# EAGLE design old_main_board (EAGLE 7.7.0)
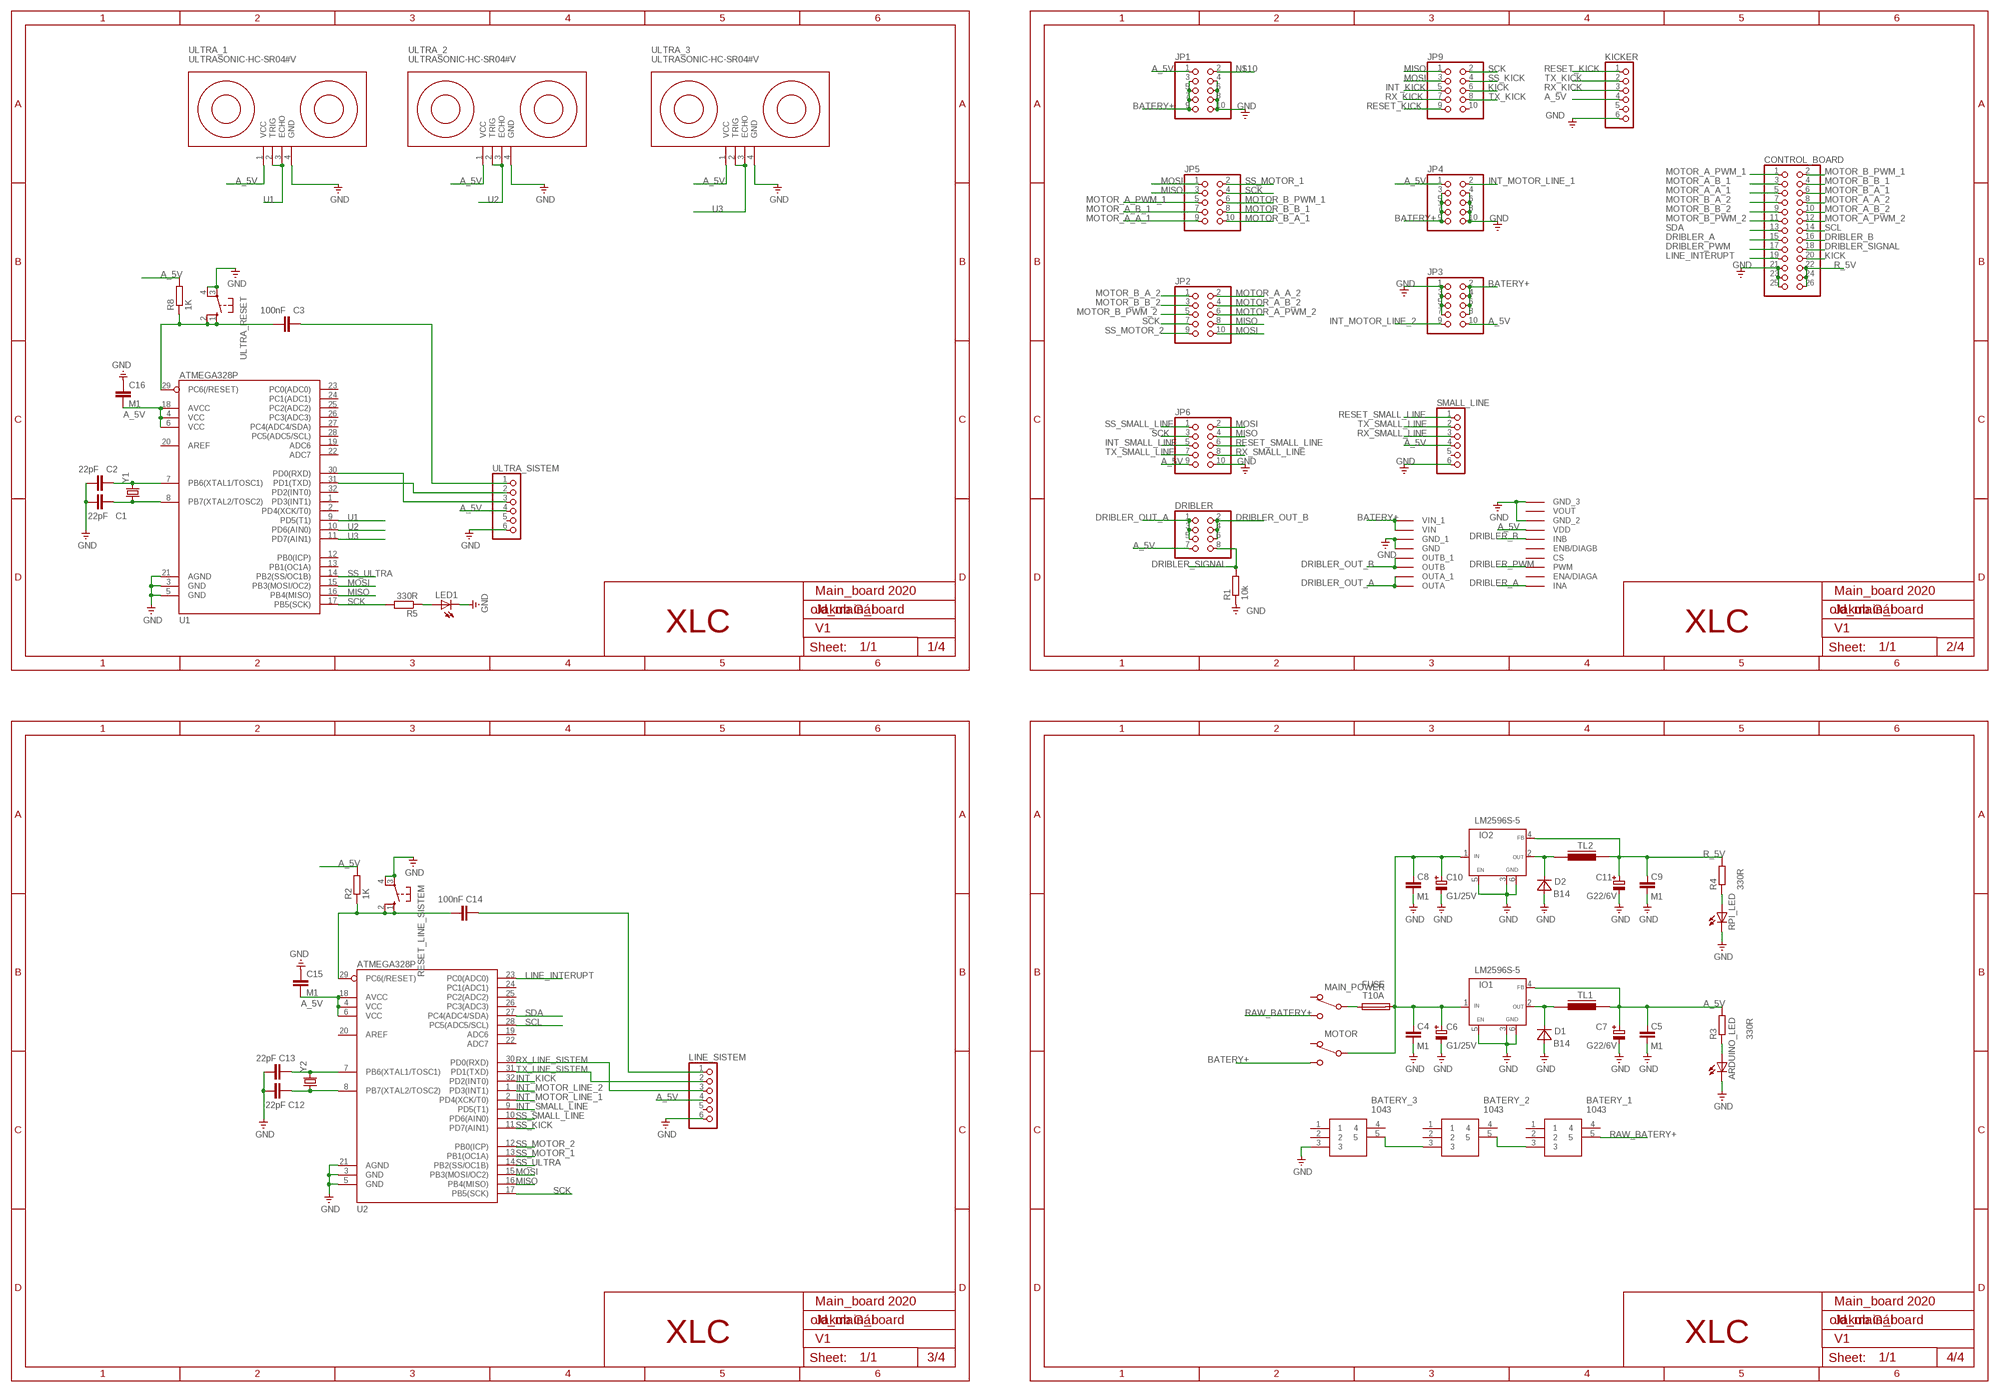
[diagram p0: schematic, sheet 1]

## Parts
ARDUINO_LED  LEDCHIPLED_0603  [CHIPLED_0603]
BATERY_1  1043  [1043]
BATERY_2  1043  [1043]
BATERY_3  1043  [1043]
C1  22pF  C-EUC0603  [C0603]
C2  22pF  C-EUC0603  [C0603]
C3  100nF  C-EUC0603  [C0603]
C4  M1  KOND-KERAM1206-SMD  [SMD-1206]
C5  M1  KOND-KERAM1206-SMD  [SMD-1206]
C6  G1/25V  KOND-ELEKTD-SMD  [SMD-ELE-D]
C7  G22/6V  KOND-ELEKTD-SMD  [SMD-ELE-D]
C8  M1  KOND-KERAM1206-SMD  [SMD-1206]
C9  M1  KOND-KERAM1206-SMD  [SMD-1206]
C10  G1/25V  KOND-ELEKTD-SMD  [SMD-ELE-D]
C11  G22/6V  KOND-ELEKTD-SMD  [SMD-ELE-D]
C12  22pF  C-EUC0603  [C0603]
C13  22pF  C-EUC0603  [C0603]
C14  100nF  C-EUC0603  [C0603]
C15  M1  C-EUC0603  [C0603]
C16  M1  C-EUC0603  [C0603]
CONTROL_BOARD  PINHD-2X13_2.54  [2X13]
D1  B14  DIODASMD-3,6X5,5  [D-3,6X5,5]
D2  B14  DIODASMD-3,6X5,5  [D-3,6X5,5]
DRIBLER  PINHD-2X4_2.54-SMD  [2X04SMD]
FUSE  T10A  POISTKA2A  [SH22,5A]
IO1  LM2596S-5  LM2596S  [TO263-5]
IO2  LM2596S-5  LM2596S  [TO263-5]
JP1  PINHD-2X5IDC  [2X05_IDC]
JP2  PINHD-2X5IDC  [2X05_IDC]
JP3  PINHD-2X5IDC  [2X05_IDC]
JP4  PINHD-2X5IDC  [2X05_IDC]
JP5  PINHD-2X5IDC  [2X05_IDC]
JP6  PINHD-2X5IDC  [2X05_IDC]
JP9  PINHD-2X5IDC  [2X05_IDC]
KICKER  PINHD-1X6  [1X06]
LED1  LEDCHIPLED_0603  [CHIPLED_0603]
LINE_SISTEM  PINHD-1X6  [1X06]
MAIN_POWER  PREP-1PB  [P-B069B]
MOTOR  PREP-1PB  [P-B069B]
R1  10k  R-EU_R0603  [R0603]
R2  1K  R-EU_R0603  [R0603]
R3  330R  R-EU_R0603  [R0603]
R4  330R  R-EU_R0603  [R0603]
R5  330R  R-EU_R0603  [R0603]
R8  1K  R-EU_R0603  [R0603]
RESET_LINE_SISTEM  10-XX  [B3F-10XX]
RPI_LED  LEDCHIPLED_0603  [CHIPLED_0603]
SMALL_LINE  PINHD-1X6  [1X06]
TL1  INDUK-TLSMD1  [INDUK-TL]
TL2  INDUK-TLSMD1  [INDUK-TL]
U1  ATMEGA328P  ATMEGA328_SMT  [TQFP32-08]
U2  ATMEGA328P  ATMEGA328_SMT  [TQFP32-08]
U$4  MOTOR_DRIVER  [MOTOR_DRIVER]
ULTRA_1  ULTRASONIC-HC-SR04#V  [ULTRASONIC-HC-SR04#V]
ULTRA_2  ULTRASONIC-HC-SR04#V  [ULTRASONIC-HC-SR04#V]
ULTRA_3  ULTRASONIC-HC-SR04#V  [ULTRASONIC-HC-SR04#V]
ULTRA_RESET  10-XX  [B3F-10XX]
ULTRA_SISTEM  PINHD-1X6  [1X06]
Y1  CRYSTALHC49US  [HC49US]
Y2  CRYSTALHC49US  [HC49US]

## Nets
A_5V: C5.2 C7.PLUS C15.2 C16.2 DRIBLER.7 IO1.4(FB) JP1.1 JP3.10 JP4.1 JP6.9 KICKER.4 LINE_SISTEM.4 R2.2 R3.2 R8.2 SMALL_LINE.4 TL1.2 U1.4(VCC) U1.6(VCC) U1.18(AVCC) U2.4(VCC) U2.6(VCC) U2.18(AVCC) U$4.VDD ULTRA_1.1(VCC) ULTRA_2.1(VCC) ULTRA_3.1(VCC) ULTRA_SISTEM.4
BATERY+: JP1.3 JP1.5 JP1.7 JP1.9 JP3.2 JP3.4 JP3.6 JP3.8 JP4.3 JP4.5 JP4.7 JP4.9 MOTOR.1(1-OFF) U$4.VIN U$4.VIN_1
DRIBLER_A: CONTROL_BOARD.15 U$4.INA
DRIBLER_B: CONTROL_BOARD.16 U$4.INB
DRIBLER_OUT_A: DRIBLER.1 DRIBLER.3 DRIBLER.5 U$4.OUTA U$4.OUTA_1
DRIBLER_OUT_B: DRIBLER.2 DRIBLER.4 DRIBLER.6 U$4.OUTB U$4.OUTB_1
DRIBLER_PWM: CONTROL_BOARD.17 U$4.PWM
DRIBLER_SIGNAL: CONTROL_BOARD.18 DRIBLER.8 R1.2
GND: ARDUINO_LED.C BATERY_3.3 C1.1 C2.1 C4.1 C5.1 C6.MINUS C7.MINUS C8.1 C9.1 C10.MINUS C11.MINUS C12.1 C13.1 C15.1 C16.1 CONTROL_BOARD.21 CONTROL_BOARD.23 CONTROL_BOARD.25 D1.A D2.A IO1.3(GND) IO1.5(EN) IO1.6(GND) IO2.3(GND) IO2.5(EN) IO2.6(GND) JP1.4 JP1.6 JP1.8 JP1.10 JP3.1 JP3.3 JP3.5 JP3.7 JP4.4 JP4.6 JP4.8 JP4.10 JP6.10 KICKER.6 LED1.C LINE_SISTEM.6 R1.1 RESET_LINE_SISTEM.3(P) RESET_LINE_SISTEM.4(P1) RPI_LED.C SMALL_LINE.6 U1.3(GND) U1.5(GND) U1.21(AGND) U2.3(GND) U2.5(GND) U2.21(AGND) U$4.GND U$4.GND_1 U$4.GND_2 U$4.GND_3 ULTRA_1.4(GND) ULTRA_2.4(GND) ULTRA_3.4(GND) ULTRA_RESET.3(P) ULTRA_RESET.4(P1) ULTRA_SISTEM.6
INT_KICK: JP9.5 U2.32(PD2(INT0))
INT_MOTOR_LINE_1: JP4.2 U2.2(PD4(XCK/T0))
INT_MOTOR_LINE_2: JP3.9 U2.1(PD3(INT1))
INT_SMALL_LINE: JP6.5 U2.9(PD5(T1))
KICK: CONTROL_BOARD.20 JP9.6
LINE_INTERUPT: CONTROL_BOARD.19 U2.23(PC0(ADC0))
MISO: JP2.8 JP5.3 JP6.4 JP9.1 U1.16(PB4(MISO)) U2.16(PB4(MISO))
MOSI: JP2.10 JP5.1 JP6.2 JP9.3 U1.15(PB3(MOSI/OC2)) U2.15(PB3(MOSI/OC2))
MOTOR_A_A_1: CONTROL_BOARD.5 JP5.9
MOTOR_A_A_2: CONTROL_BOARD.8 JP2.2
MOTOR_A_B_1: CONTROL_BOARD.3 JP5.7
MOTOR_A_B_2: CONTROL_BOARD.10 JP2.4
MOTOR_A_PWM_1: CONTROL_BOARD.1 JP5.5
MOTOR_A_PWM_2: CONTROL_BOARD.12 JP2.6
MOTOR_B_A_1: CONTROL_BOARD.6 JP5.10
MOTOR_B_A_2: CONTROL_BOARD.7 JP2.1
MOTOR_B_B_1: CONTROL_BOARD.4 JP5.8
MOTOR_B_B_2: CONTROL_BOARD.9 JP2.3
MOTOR_B_PWM_1: CONTROL_BOARD.2 JP5.6
MOTOR_B_PWM_2: CONTROL_BOARD.11 JP2.5
N$1: BATERY_1.3 BATERY_2.5
N$2: BATERY_2.3 BATERY_3.5
N$3: D2.K IO2.2(OUT) TL2.1
N$4: FUSE.1 MAIN_POWER.2(2-COM)
N$5: C13.2 U2.7(PB6(XTAL1/TOSC1)) Y2.2
N$6: D1.K IO1.2(OUT) TL1.1
N$7: C2.2 U1.7(PB6(XTAL1/TOSC1)) Y1.2
N$8: C1.2 U1.8(PB7(XTAL2/TOSC2)) Y1.1
N$9: C12.2 U2.8(PB7(XTAL2/TOSC2)) Y2.1
N$10: JP1.2
N$12: C14.2 LINE_SISTEM.1
N$13: C14.1 R2.1 RESET_LINE_SISTEM.1(S) RESET_LINE_SISTEM.2(S1) U2.29(PC6(/RESET))
N$14: C4.2 C6.PLUS C8.2 C10.PLUS FUSE.2 IO1.1(IN) IO2.1(IN) MOTOR.2(2-COM)
N$16: U1.30(PD0(RXD)) ULTRA_SISTEM.3
N$17: U1.31(PD1(TXD)) ULTRA_SISTEM.2
N$18: C3.2 ULTRA_SISTEM.1
N$19: C3.1 R8.1 U1.29(PC6(/RESET)) ULTRA_RESET.1(S) ULTRA_RESET.2(S1)
N$20: LED1.A R5.1
N$22: ARDUINO_LED.A R3.1
N$23: R4.1 RPI_LED.A
R_5V: C9.2 C11.PLUS CONTROL_BOARD.22 CONTROL_BOARD.24 CONTROL_BOARD.26 IO2.4(FB) R4.2 TL2.2
RAW_BATERY+: BATERY_1.5 MAIN_POWER.1(1-OFF)
RESET_KICK: JP9.9 KICKER.1
RESET_SMALL_LINE: JP6.6 SMALL_LINE.1
RX_KICK: JP9.7 KICKER.3
RX_LINE_SISTEM: LINE_SISTEM.3 U2.30(PD0(RXD))
RX_SMALL_LINE: JP6.8 SMALL_LINE.3
SCK: JP2.7 JP5.4 JP6.3 JP9.2 R5.2 U1.17(PB5(SCK)) U2.17(PB5(SCK))
SCL: CONTROL_BOARD.14 U2.28(PC5(ADC5/SCL))
SDA: CONTROL_BOARD.13 U2.27(PC4(ADC4/SDA))
SS_KICK: JP9.4 U2.11(PD7(AIN1))
SS_MOTOR_1: JP5.2 U2.13(PB1(OC1A))
SS_MOTOR_2: JP2.9 U2.12(PB0(ICP))
SS_SMALL_LINE: JP6.1 U2.10(PD6(AIN0))
SS_ULTRA: U1.14(PB2(SS/OC1B)) U2.14(PB2(SS/OC1B))
TX_KICK: JP9.8 KICKER.2
TX_LINE_SISTEM: LINE_SISTEM.2 U2.31(PD1(TXD))
TX_SMALL_LINE: JP6.7 SMALL_LINE.2
U1: U1.9(PD5(T1)) ULTRA_1.2(TRIG) ULTRA_1.3(ECHO)
U2: U1.10(PD6(AIN0)) ULTRA_2.2(TRIG) ULTRA_2.3(ECHO)
U3: U1.11(PD7(AIN1)) ULTRA_3.2(TRIG) ULTRA_3.3(ECHO)
Unconnected: BATERY_1.1 BATERY_1.2 BATERY_1.4 BATERY_2.1 BATERY_2.2 BATERY_2.4 BATERY_3.1 BATERY_3.2 BATERY_3.4 JP9.10 KICKER.5 LINE_SISTEM.5 MAIN_POWER.3(3-ON) MOTOR.3(3-ON) SMALL_LINE.5 U1.1(PD3(INT1)) U1.2(PD4(XCK/T0)) U1.12(PB0(ICP)) U1.13(PB1(OC1A)) U1.19(ADC6) U1.20(AREF) U1.22(ADC7) U1.23(PC0(ADC0)) U1.24(PC1(ADC1)) U1.25(PC2(ADC2)) U1.26(PC3(ADC3)) U1.27(PC4(ADC4/SDA)) U1.28(PC5(ADC5/SCL)) U1.32(PD2(INT0)) U2.19(ADC6) U2.20(AREF) U2.22(ADC7) U2.24(PC1(ADC1)) U2.25(PC2(ADC2)) U2.26(PC3(ADC3)) U$4.CS U$4.ENA/DIAGA U$4.ENB/DIAGB U$4.VOUT ULTRA_SISTEM.5

## Notes on the sheet
- Main_board 2020 | Main_board 2020
- Jakub Gál | Jakub Gál
- XLC | V1 | XLC | V1
- 1/4 | 2/4
- Main_board 2020 | Main_board 2020
- Jakub Gál | Jakub Gál
- XLC | V1 | XLC | V1
- 3/4 | 4/4

## Library data of the parts
ARDUINO_LED LED1 RPI_LED = audio amplifier example:LED
BATERY_1-BATERY_3 = SamacSys_Parts:1043: KEYSTONE - 1043 - BATTERY HOLDER, 18650, TH Source: Datasheet <https://componentsearchengine.com/Datasheets/1/1043.pdf>; DESCRIPTION: KEYSTONE - 1043 - BATTERY HOLDER, 18650, TH; HEIGHT: mm; MANUFACTURER_NAME: Keystone Electronics; MANUFACTURER_PART_NUMBER: 1043; MOUSER_PART_NUMBER: 534-1043; MOUSER_PRICE-STOCK: https://www.mouser.com/Search/Refine.aspx?Keyword=534-1043
C1-C3 C12-C14 = rcl@1:C-EU: CAPACITOR, European symbol
C4 C5 C8 C9 = TABOR K1:KOND-KERAM: Kondenzátor keramicky
C6 C7 C10 C11 = TABOR K1:KOND-ELEKT: Kondenzátor elektrolyticky
C15 C16 = rcl:C-EU: CAPACITOR, European symbol; SPICEPREFIX: C
CONTROL_BOARD = pinhead-1:PINHD-2X13: PIN HEADER
D1 D2 = TABOR K1:DIODA: Dioda
DRIBLER = pinhead-1:PINHD-2X4: PIN HEADER
FUSE = TABOR K1:POISTKA2: Drziak sklopistky SH22,5A / vzdialenost vyvodov 22,5 mm /
IO1 IO2 = TABOR K1:LM2596: DC/DC pulzny regulator STEP-DOWN / 3A upraveny podla katalogu
JP1-JP6 JP9 = pinhead-1:PINHD-2X5: PIN HEADER
KICKER LINE_SISTEM SMALL_LINE ULTRA_SISTEM = pinhead:PINHD-1X6: PIN HEADER
MAIN_POWER MOTOR = TABOR K1:PREP-1P: 1-polovy prepinac
R1-R5 R8 = rcl:R-EU_: RESISTOR, European symbol; SPICEPREFIX: R
RESET_LINE_SISTEM ULTRA_RESET = switch-omron:10-XX: OMRON SWITCH; MPN: B3F-1000; OC_FARNELL: 176432; OC_NEWARK: 36M3542
TL1 TL2 = TABOR K1:INDUK-TL: Tlmivka
U1 U2 = SparkFun-DigitalIC:ATMEGA328_SMT: 32-Pin Atmega328 part Commonly used on Arduino compatible boards Available in QFP and QFN packages TQFP is IC-09069 QFN is non-stock; PROD_ID: IC-09069
U$4 = Moja:MOTOR_DRIVER
ULTRA_1-ULTRA_3 = diy-modules:ULTRASONIC-HC-SR04: Ultrasonic Ranging Module HC-SR04 More details available here: http://randomnerdtutorials.com/complete-guide-for-ultrasonic-sensor-hc-sr04/ Click here to find device on ebay.com <http://www.ebay.com/sch/hc+sr04+ultrasonic>
Y1 Y2 = SparkFun-FreqCtrl:CRYSTAL: Various standard crystals. Proven footprints. Spark Fun Electronics SKU : COM-00534

## Board
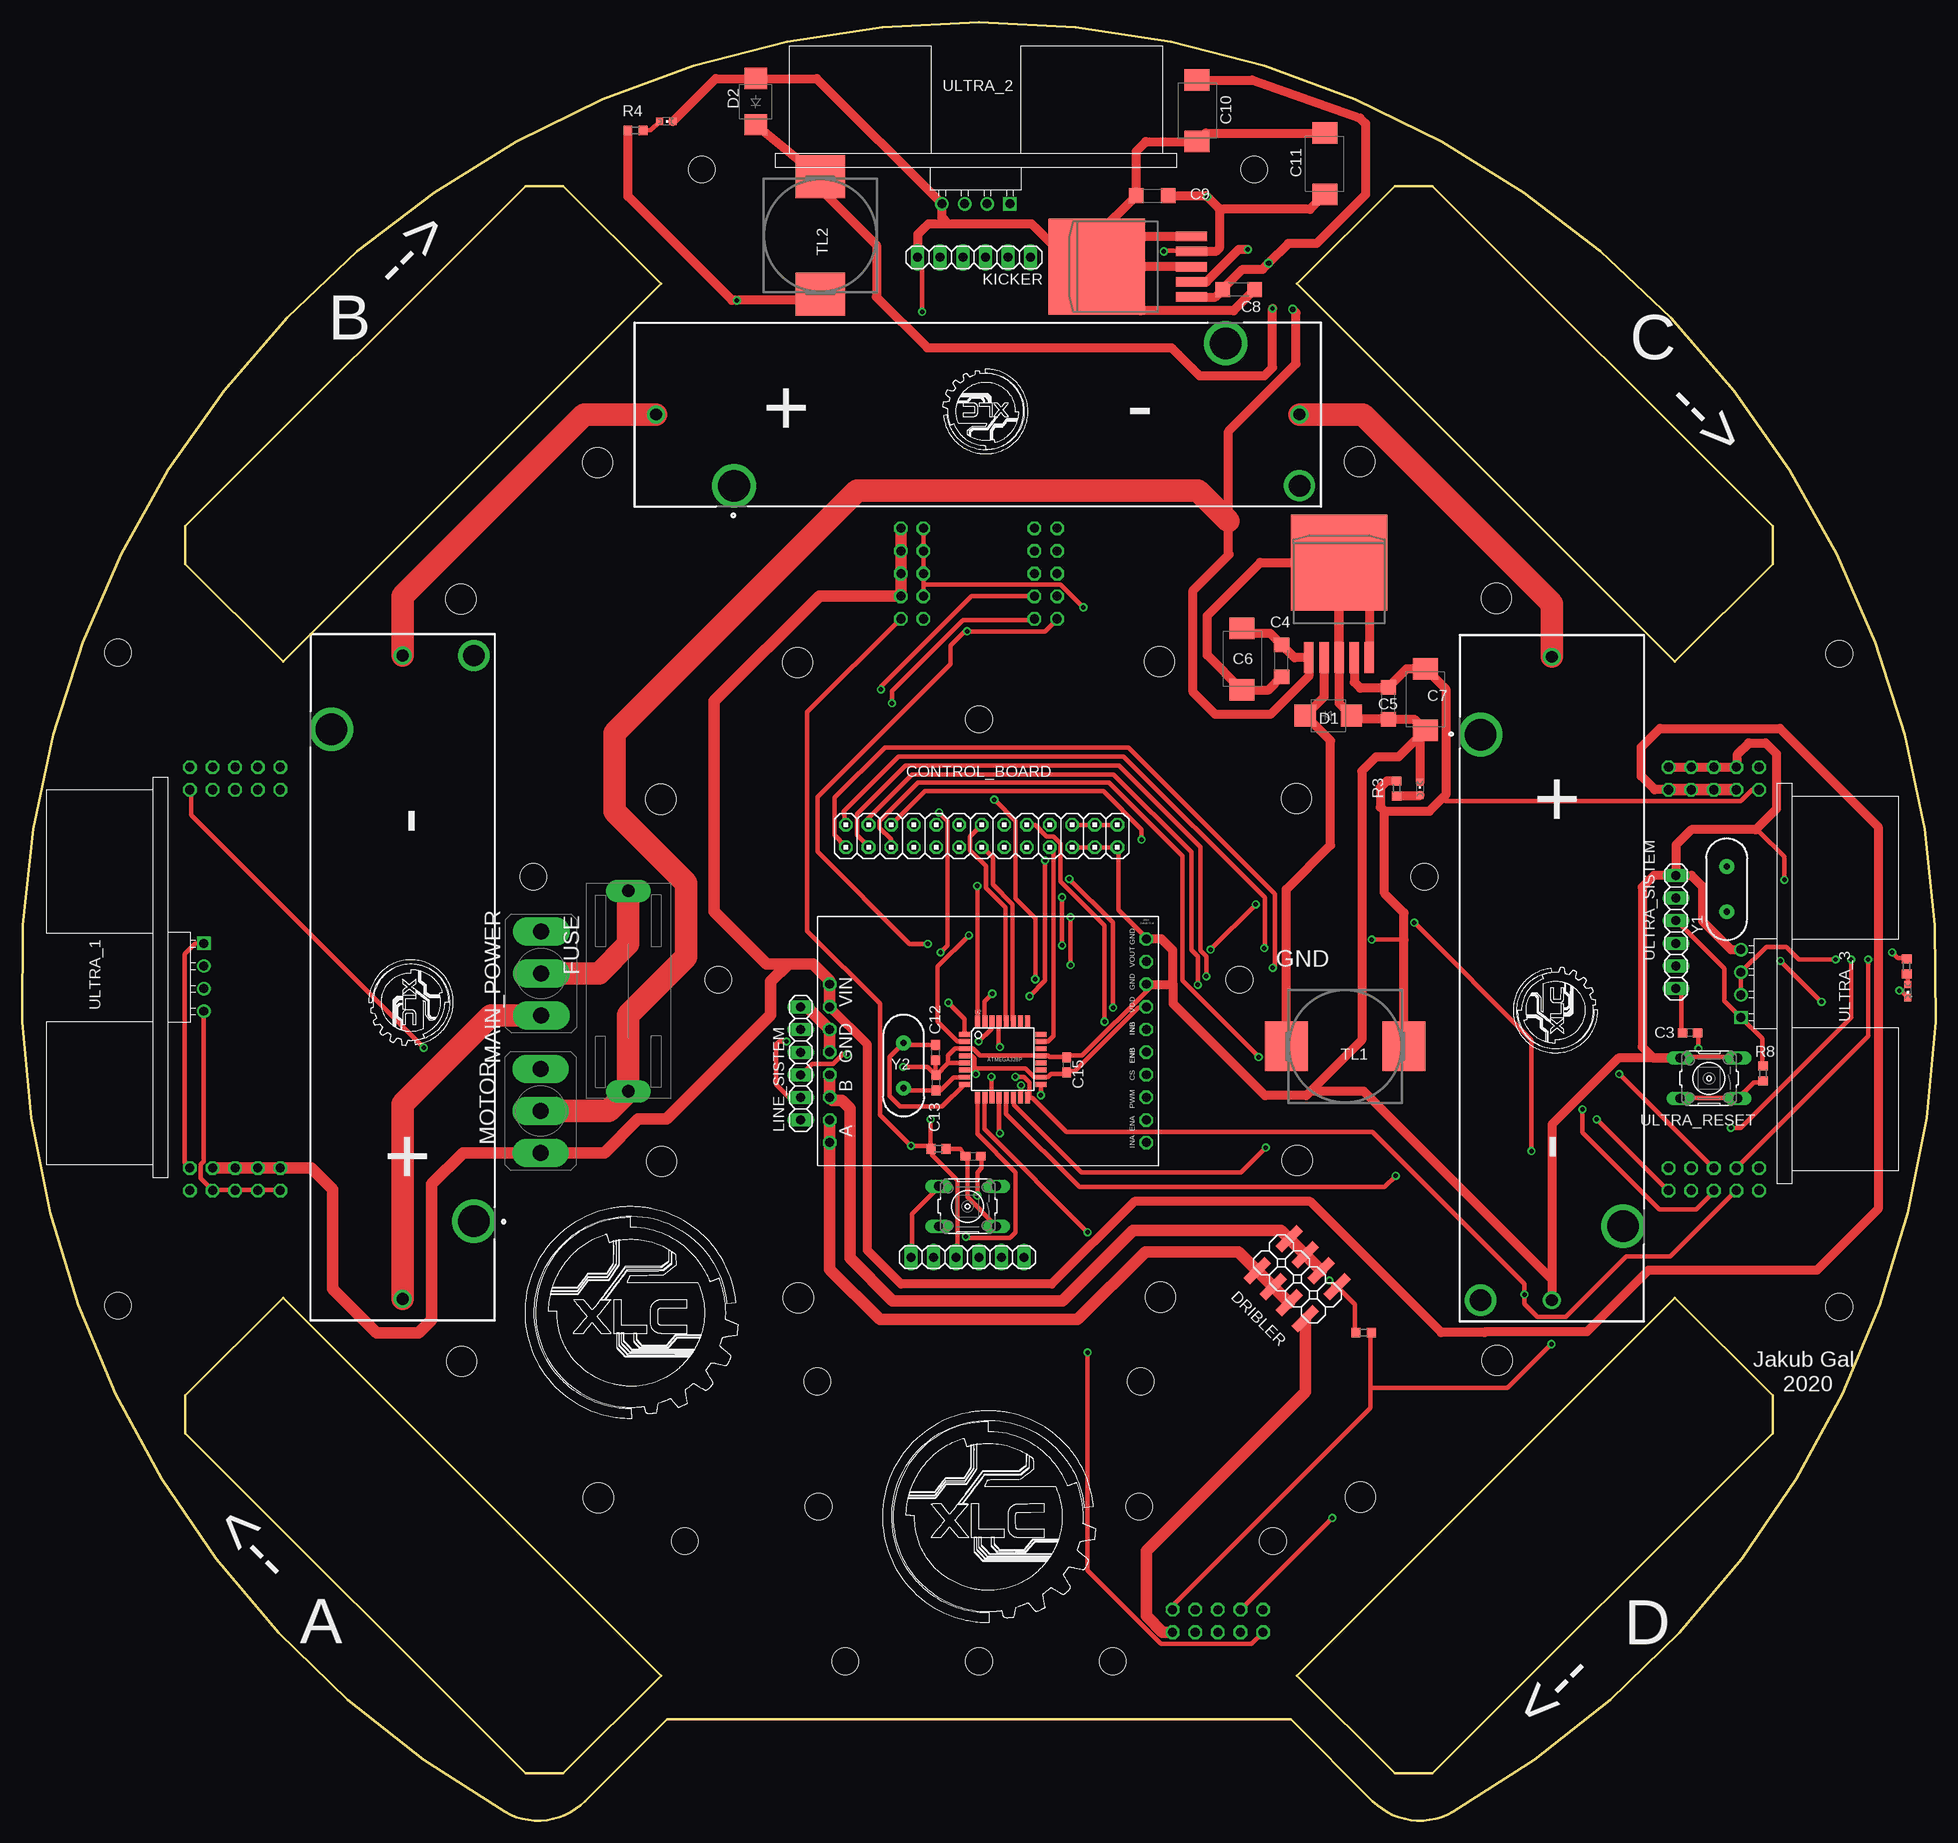
[diagram p1: board, top side]
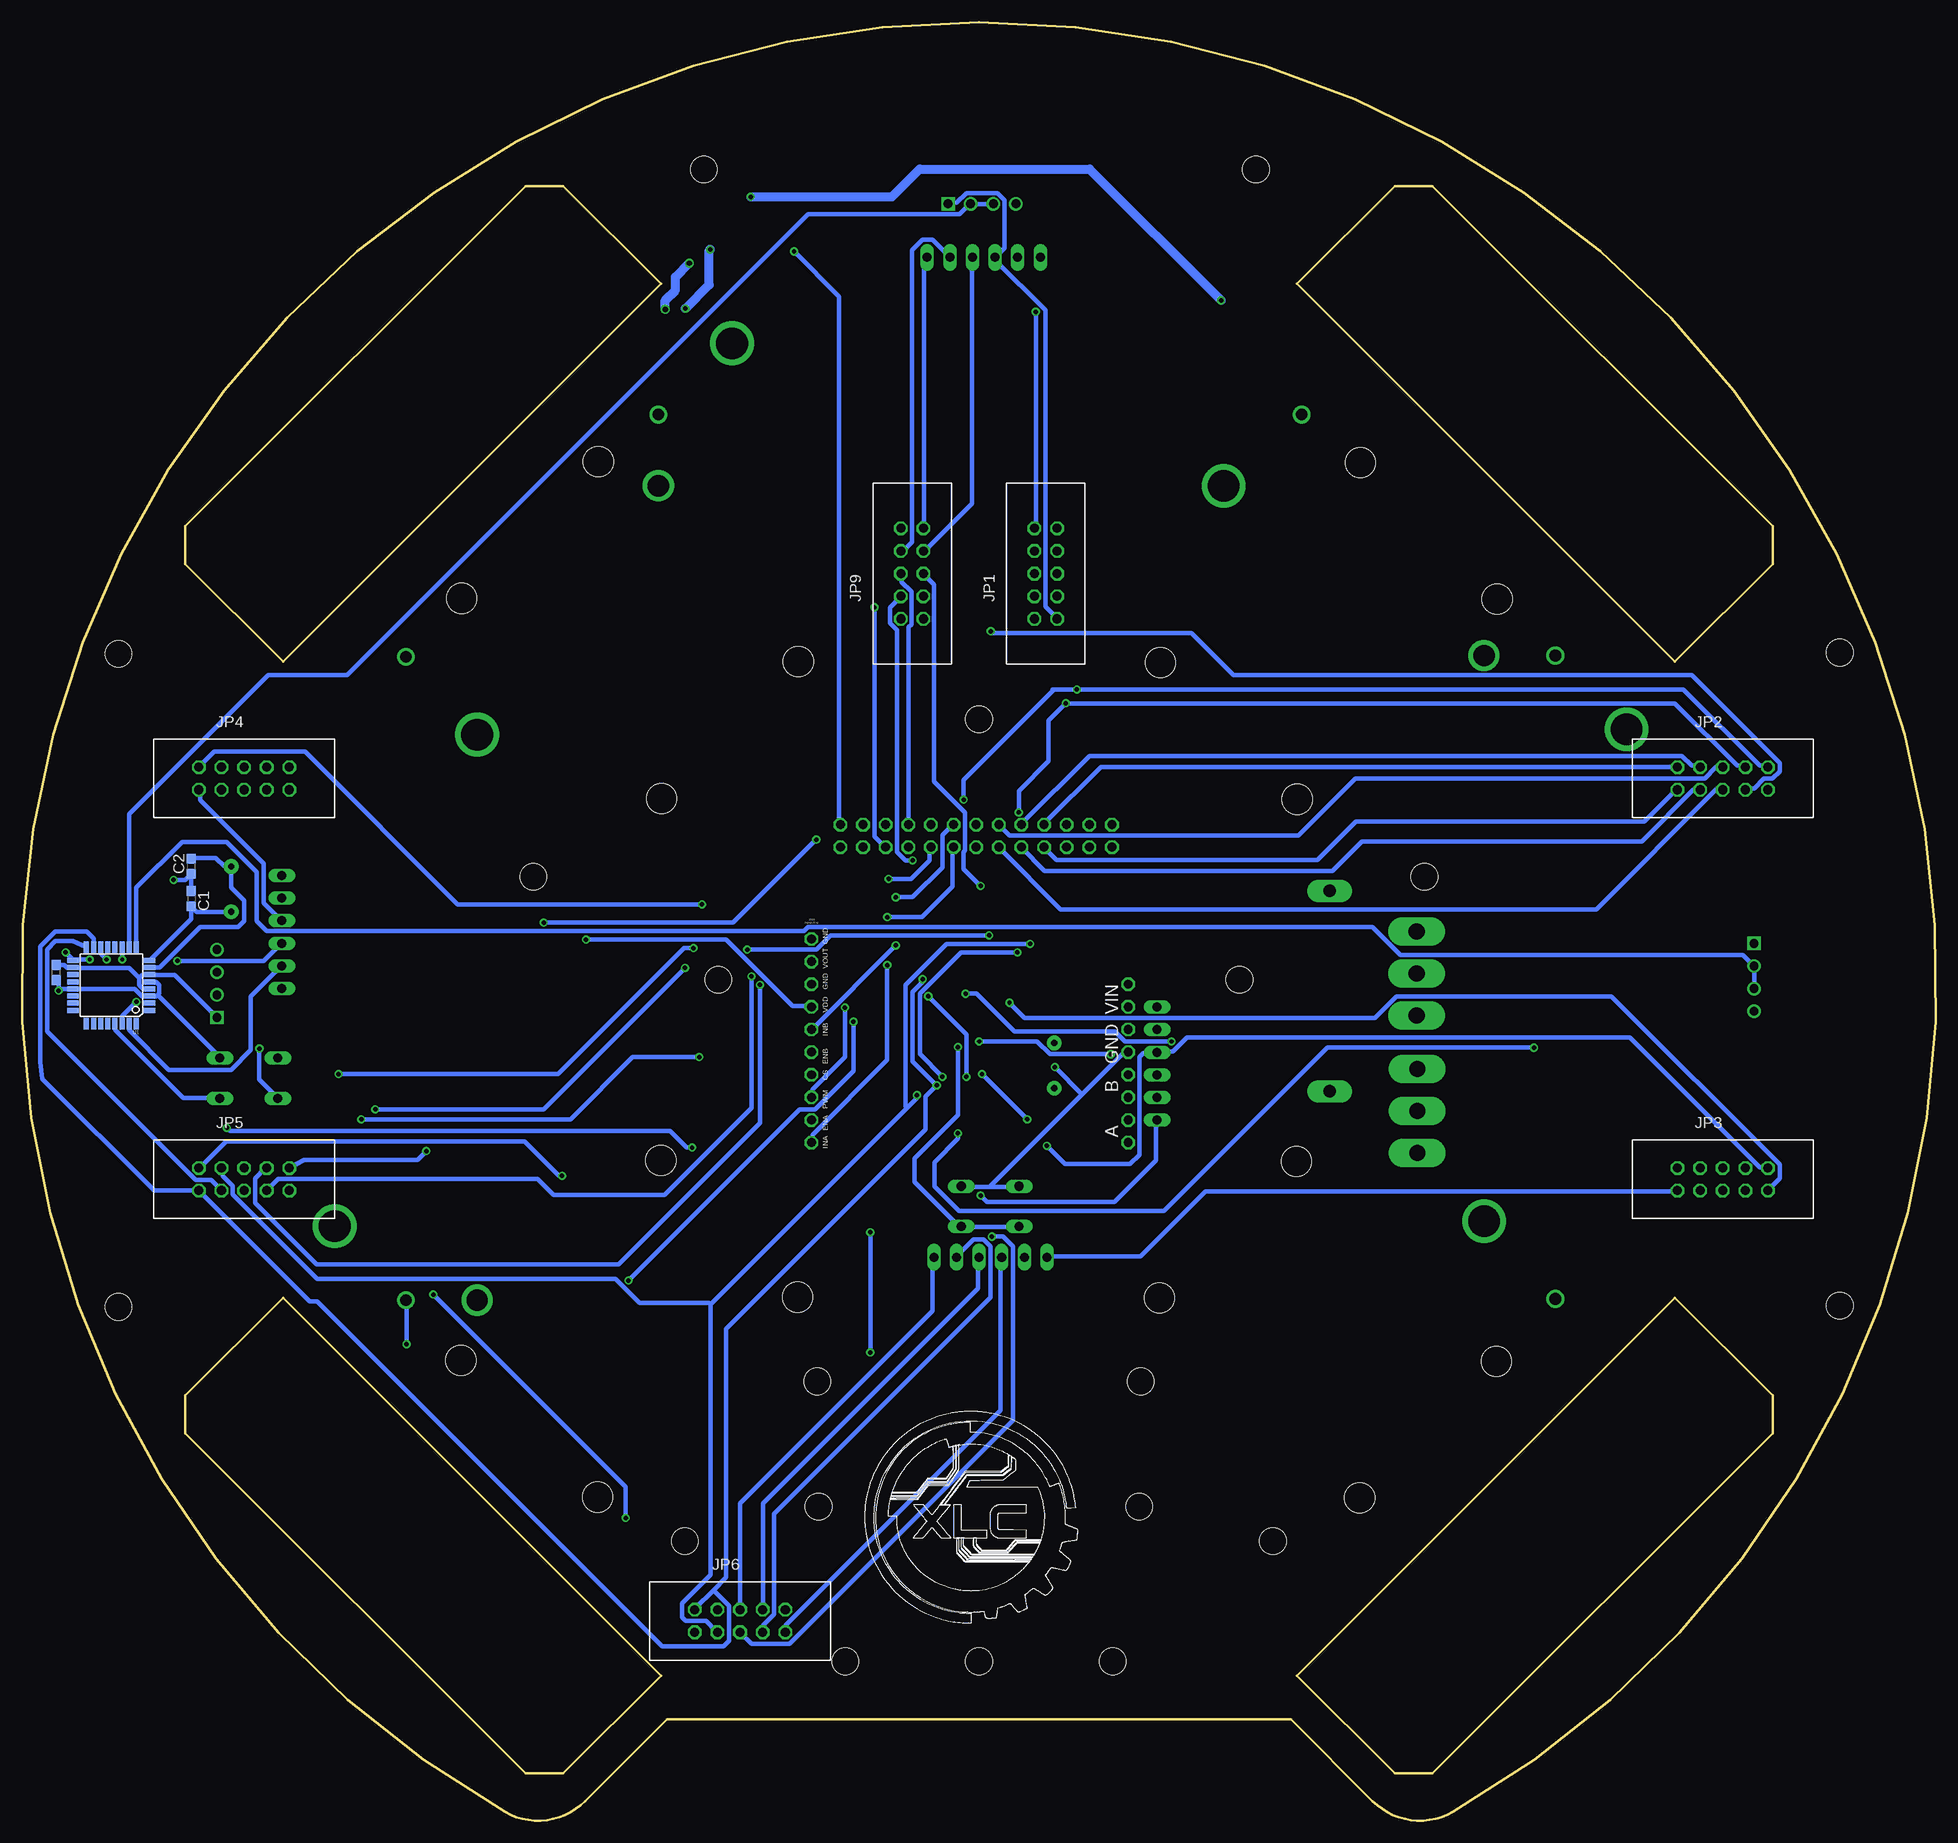
[diagram p2: board, bottom side, seen from below]

Size 214.79 x 201.89 mm. Coordinates in mm from the lower left corner, seen from the top.
Outline: 63.2,2.19 72.4,11.38 142.4,11.38 151.59,2.19 arc75 160.61,0.98 arc301 54.19,0.98 arc75 63.2,2.19
Outline: 29.26,130.09 18.3,141.05 18.3,145.3 56.49,183.48 60.73,183.48 71.69,172.52 29.26,130.09
Outline: 196.49,47.72 196.49,43.47 158.31,5.29 154.07,5.29 143.11,16.25 185.53,58.68 196.49,47.72
Outline: 71.69,16.25 60.73,5.29 56.49,5.29 18.3,43.47 18.3,47.72 29.26,58.68 71.69,16.25
Outline: 143.11,172.52 154.07,183.48 158.31,183.48 196.49,145.3 196.49,141.05 185.53,130.09 143.11,172.52
Copper layers (1*16): Top 0.035mm / dielectric 1.5mm / Bottom 0.035mm
Design rules "default *": minimum track width 20mil, minimum drill 0.5mm, track to track 6mil, track to pad 6mil, pad to pad 6mil, via to via 6mil, smd to smd 6mil, copper to edge 40mil, drill to drill 6mil, minimum pad ring 10mil, minimum via ring 8mil, stop-mask expansion 4mil, vias tented up to drill 0mil, thermal gap 10mil
Holes 3 mm at 107.4,17.88 74.4,31.38 92.4,17.88 10.76,131.13 140.4,31.38 89.4,35.23 57.4,105.94 203.98,57.68 157.4,105.94 203.98,130.99 125.4,35.23 10.76,57.82 76.3,185.36 122.4,17.88 138.3,185.36 89.24,49.3 107.4,123.63 125.56,49.3 136.64,94.38 78.15,94.38
Holes 3.4 mm at 64.67,36.22 165.56,51.65 150.13,152.55 49.32,51.56 64.58,152.46 127.77,58.76 87.12,58.67 150.22,36.31 71.77,74.01 143.11,74.1 165.47,137.21 71.68,114.67 127.68,130.1 49.23,137.12 87.03,130.01 143.02,114.76

### Footprints (pad centres in the part's own frame; a part is rotated, then mirrored left to right if it is on the bottom)
CHIPLED_0603 = smd 0.8 x 0.8: A 0,-0.75; C 0,0.75
1043 = drill 3.55 pad 4.9: 1 0,0; 4 55.2,16 | drill 2.39 pad 3.5: 2 63.48,0 | drill 1.32 pad 2: 3 63.48,8; 5 -8.74,8
C0603 = smd 1.1 x 1: 1 -0.85,0; 2 0.85,0
SMD-1206 = smd 1.626 x 1.702: 1 -1.803,0; 2 1.803,0
SMD-ELE-D = smd 2.438 x 2.794: MINUS 3.454,0; PLUS -3.454,0
2X13 = drill 1.016 octagon: 1 -15.24,-1.27; 2 -15.24,1.27; 3 -12.7,-1.27; 4 -12.7,1.27; 5 -10.16,-1.27; 6 -10.16,1.27; 7 -7.62,-1.27; 8 -7.62,1.27; 9 -5.08,-1.27; 10 -5.08,1.27; 11 -2.54,-1.27; 12 -2.54,1.27; 13 0,-1.27; 14 0,1.27; 15 2.54,-1.27; 16 2.54,1.27; 17 5.08,-1.27; 18 5.08,1.27; 19 7.62,-1.27; 20 7.62,1.27; 21 10.16,-1.27; 22 10.16,1.27; 23 12.7,-1.27; 24 12.7,1.27; 25 15.24,-1.27; 26 15.24,1.27
D-3,6X5,5 = smd 2.388 x 2.489: A 2.591,0; K -2.591,0
2X04SMD = smd 1.016 x 3.302: 1 -1.27,-3.81; 2 -1.27,1.27; 3 1.27,-3.81; 4 1.27,1.27; 5 3.81,-3.81; 6 3.81,1.27; 7 6.35,-3.81; 8 6.35,1.27
SH22,5A = drill 1.397 pad 2.54 long: 1 -11.252,0; 2 11.252,0
TO263-5 = smd 1.067 x 3.505: 1 -3.404,0.762; 2 -1.702,0.762; 3 0,0.762; 4 1.702,0.762; 5 3.404,0.762 | smd 10.82 x 10.82: 6 0,11.43
2X05_IDC = drill 1.016 octagon: 1 -5.08,-1.27; 2 -5.08,1.27; 3 -2.54,-1.27; 4 -2.54,1.27; 5 0,-1.27; 6 0,1.27; 7 2.54,-1.27; 8 2.54,1.27; 9 5.08,-1.27; 10 5.08,1.27
1X06 = drill 1.016 long: 1 -6.35,0; 2 -3.81,0; 3 -1.27,0; 4 1.27,0; 5 3.81,0; 6 6.35,0
P-B069B = drill 1.803 pad 3.175 long: 1 -4.699,0; 2 0,0; 3 4.699,0
R0603 = smd 1 x 1.1: 1 -0.85,0; 2 0.85,0
B3F-10XX = drill 1.016 long: 1 -3.251,2.261; 2 3.251,2.261; 3 -3.251,-2.261; 4 3.251,-2.261
INDUK-TL = smd 4.826 x 5.588: 1 -6.604,0; 2 6.604,0
TQFP32-08 = smd 1.27 x 0.559: 1 -4.293,2.8; 2 -4.293,2; 3 -4.293,1.2; 4 -4.293,0.4; 5 -4.293,-0.4; 6 -4.293,-1.2; 7 -4.293,-2; 8 -4.293,-2.8; 17 4.293,-2.8; 18 4.293,-2; 19 4.293,-1.2; 20 4.293,-0.4; 21 4.293,0.4; 22 4.293,1.2; 23 4.293,2; 24 4.293,2.8 | smd 0.559 x 1.27: 9 -2.8,-4.293; 10 -2,-4.293; 11 -1.2,-4.293; 12 -0.4,-4.293; 13 0.4,-4.293; 14 1.2,-4.293; 15 2,-4.293; 16 2.8,-4.293; 25 2.8,4.293; 26 2,4.293; 27 1.2,4.293; 28 0.4,4.293; 29 -0.4,4.293; 30 -1.2,4.293; 31 -2,4.293; 32 -2.8,4.293
MOTOR_DRIVER = drill 1 octagon: CS -2.54,-17.78; ENA/DIAGA -7.62,-17.78; ENB/DIAGB 0,-17.78; GND 0,17.78; GND_1 2.54,17.78; GND_2 7.62,-17.78; GND_3 12.7,-17.78; INA -10.16,-17.78; INB 2.54,-17.78; OUTA -10.16,17.78; OUTA_1 -7.62,17.78; OUTB -5.08,17.78; OUTB_1 -2.54,17.78; PWM -5.08,-17.78; VDD 5.08,-17.78; VIN 5.08,17.78; VIN_1 7.62,17.78; VOUT 10.16,-17.78
ULTRASONIC-HC-SR04#V = drill 1 square: 1 -3.81,0 | drill 1: 2 -1.27,0; 3 1.27,0; 4 3.81,0
HC49US = drill 0.7 pad 1.651: 1 -2.54,0; 2 2.54,0

### Placement (x,y rotation side)
ARDUINO_LED  156.91,115.86 0 top
BATERY_1  50.7,67.3 90 top
BATERY_2  79.91,149.85 0 top
BATERY_3  163.73,121.91 270 top
C1  195.83,103.5 270 bottom
C2  195.82,107.13 90 bottom
C3  187.23,88.44 180 top
C4  141.37,130.21 90 top
C5  153.37,125.44 90 top
C6  136.93,130.4 270 top
C7  157.51,125.86 270 top
C8  136.55,171.85 180 top
C9  126.86,182.43 0 top
C10  131.88,191.95 270 top
C11  146.22,186 90 top
C12  102.54,86.22 90 top
C13  102.56,82.83 270 top
C14  106.74,74.59 0 top
C15  117.26,84.82 270 top
C16  210.98,95.2 90 bottom
CONTROL_BOARD  107.71,110.54 0 top
D1  146.62,124.05 0 top
D2  82.35,192.97 90 top
DRIBLER  142.23,63.53 315 top
FUSE  68.03,93.13 270 top
IO1  147.83,129.8 0 top
IO2  132.03,174.45 90 top
JP1  99.9,139.99 90 bottom
JP2  23.9,116.99 0 bottom
JP3  23.9,71.99 0 bottom
JP4  189.9,116.99 0 bottom
JP5  189.9,71.99 0 bottom
JP6  134.22,22.4 0 bottom
JP9  114.9,139.99 90 bottom
KICKER  106.86,175.51 180 top
LED1  211.69,93.12 180 top
LINE_SISTEM  87.39,84.98 90 top
MAIN_POWER  58.26,95.1 90 top
MOTOR  58.19,79.66 90 top
R1  150.58,54.78 180 top
R2  102.86,75.42 180 top
R3  154.29,115.87 90 top
R4  68.83,189.74 180 top
R5  211.55,95.89 90 top
R8  195.42,83.87 90 top
RESET_LINE_SISTEM  106.13,68.96 180 top
RPI_LED  72.28,190.74 270 top
SMALL_LINE  106.11,63.25 180 top
TL1  148.51,86.92 0 top
TL2  89.59,177.96 270 top
U1  204.8,93.76 180 bottom
U2  110.06,85.45 0 top
U$4  108.42,86.27 90 top
ULTRA_1  20.38,94.67 270 top
ULTRA_2  107.05,181.5 180 top
ULTRA_3  192.94,93.97 90 top
ULTRA_RESET  189.36,83.33 180 top
ULTRA_SISTEM  185.65,99.75 90 top
Y1  191.35,104.56 90 top
Y2  98.94,84.75 270 top

### Tracks (layer width: path | path; a pad name or v marks a point on that pad's centre or on a via)
A_5V  (via drill 0.5)
  Top 0.508: R8.2 195.32,84.77 195.32,87.78 ULTRA_3.1 191.08,92.02 191.08,95.67 185.79,100.96 ULTRA_SISTEM.4 | JP4.1 194.84,115.72 194.21,115.72 192.94,114.45 159.76,114.45 159.43,114.78 | ULTRA_1.1 19.44,98.48 18.25,97.29 18.25,73.83 JP3.10 | 106.58,84.29 105.78,84.29 U2.6 | 106.89,84.61 106.58,84.29 | 106.89,84.61 106.89,85.56 106.58,85.88 105.78,85.88 U2.4 | 106.89,84.61 107.05,84.45 112.61,84.45 113.56,83.5 114.2,83.5 U2.18 114.36,83.5 115.15,83.5 115.47,83.81 117.21,83.81 C15.2 117.37,84.13 118.17,84.13 125.31,91.27 126.1,91.27 U$4.VDD | R2.2 102.13,75.4 102.13,74.75 104.99,71.89 104.99,63.33 SMALL_LINE.4 | R2.2 101.55,75.75 v99.77,75.75 96.3,79.23 96.3,91.71 88.11,99.9 88.11,124.45 JP1.1 | v107.05,83.81 106.58,84.29 | v101.97,78.73 101.97,75.72 R2.2 | v151.5,98.89 155.11,98.89
  Top 1.016: IO1.4 149.53,127.8 150.2,127.13 153.25,127.13 C5.2 155.44,129.32 C7.PLUS 159.86,126.97 159.86,115.2 159.43,114.78 157.97,113.31 152.92,113.31 | R3.2 153.21,116.72 152.46,115.97 152.46,113.77 152.92,113.31 | TL1.2 155.11,98.89 155.11,101.9 152.92,104.09 152.92,113.31
  Top 1.27: JP6.9 128.03,21.13 126.19,22.97 126.19,30.28 144.02,48.12 DRIBLER.7
  Bottom 0.508: C16.2 210.88,96.04 210.08,96.04 209.76,95.72 209.13,95.72 U1.18 208.97,95.72 202.78,95.72 201.67,94.61 | 201.67,94.61 201.67,93.81 201.19,93.34 200.56,93.34 U1.4 | 201.67,94.61 201.35,94.93 200.56,94.93 U1.6 200.4,94.93 197.7,94.93 ULTRA_3.1 | JP4.1 194.84,115.72 194.84,114.57 187.7,107.43 187.7,103.02 185.79,101.12 ULTRA_SISTEM.4 | ULTRA_2.1 110.86,181.6 109.91,181.6 108.8,182.71 105.31,182.71 104.51,181.92 104.51,176.52 105.47,175.57 KICKER.4 105.62,175.25 99.91,169.54 99.91,136.27 98.64,135 98.64,134.93 JP1.1 | v101.97,78.73 v107.05,83.81 | JP3.10 18.95,73.34 19.74,73.34 34.35,87.94 84.03,87.94 85.62,86.35 87.21,86.35 LINE_SISTEM.4 87.53,86.19 88.96,86.19 89.4,85.75 89.4,74.73 90.42,73.71 97.74,73.71 v99.77,75.75 | JP6.9 129.12,21.27 129.12,21.9 104.99,46.03 104.99,63.18 SMALL_LINE.4 | v151.5,98.89 135.79,98.89 128.33,91.43 126.26,91.43 U$4.VDD
BATERY+
  Top 1.016: JP4.9 183.27,115.72 181.75,117.24 181.75,120.5 183.85,122.6 197.31,122.6 208.36,111.55 208.36,68.66 201.47,61.77 182.57,61.77 175.67,54.88 164.23,54.88 164.15,54.8 159.29,54.8 144.59,69.5 124.84,69.5 115.57,60.23 98.66,60.23 94.87,64.02 94.87,87.12 U$4.VIN
  Top 1.27: JP3.8 JP3.6 JP3.4 JP3.2 32.45,73.26 34.86,70.85 34.86,59.67 39.79,54.74 44.48,54.74 45.97,56.23 45.97,71.45 49.47,74.96 MOTOR.1 65.36,74.96 69.16,78.75 72.32,78.75 84.02,90.45 84.02,94.19 86.01,96.18 | U$4.VIN U$4.VIN_1 90.64,94.31 88.77,96.18 86.01,96.18 | JP1.9 JP1.7 JP1.5 JP1.3 89.48,137.45 77.69,125.66 77.69,102.04 83.55,96.18 86.01,96.18 | JP4.9 JP4.7 JP4.5 JP4.3
DRIBLER_A  (via drill 0.5)
  Top 0.508: v117.69,101.43 v117.69,96.04
  Bottom 0.508: v117.69,96.04 117.69,85.4 126.1,76.99 126.1,76.19 U$4.INA | v117.69,101.43 113.81,101.43 110.39,104.86 110.39,109.21 CONTROL_BOARD.15
DRIBLER_B  (via drill 0.5)
  Top 0.508: v116.74,103.66 v116.74,98.26
  Bottom 0.508: v116.74,98.26 126.1,88.89 U$4.INB | v116.74,103.66 114.84,103.66 111.5,107 111.5,110.64 110.39,111.75 CONTROL_BOARD.16
DRIBLER_OUT_A
  Top 1.27: U$4.OUTA_1 U$4.OUTA 90.64,61.9 96.29,56.25 118.46,56.25 126.07,63.85 136.51,63.85 DRIBLER.1 DRIBLER.3 DRIBLER.5 | DRIBLER.5
DRIBLER_OUT_B
  Top 1.27: U$4.OUTB_1 U$4.OUTB 90.99,80.84 92.02,80.84 92.92,79.94 92.92,63.14 97.69,58.37 116.8,58.37 124.67,66.23 141.32,66.23 DRIBLER.2 DRIBLER.4 DRIBLER.6 | DRIBLER.6
DRIBLER_PWM  (via drill 0.5)
  Top 0.508: v122.45,91.27 122.45,100.8 v117.53,105.72
  Bottom 0.508: v122.45,91.27 122.45,85.72 126.1,82.07 126.1,81.27 U$4.PWM | v117.53,105.72 115.01,105.72 112.93,107.8 112.93,109.21 CONTROL_BOARD.17
DRIBLER_SIGNAL  (via drill 0.5)
  Top 0.508: R1.2 149.6,54.92 149.6,57.94 147.69,59.84 DRIBLER.8 147.38,60 v146.74,60.64 | v121.5,89.69 121.5,100.48 116.58,105.4 116.58,109.69 115.78,110.48 114.99,110.48 113.72,111.75 112.93,111.75 CONTROL_BOARD.18
  Bottom 0.508: v121.5,89.69 121.5,84.13 125.79,79.84 127.53,79.84 v146.74,60.64
GND  (via drill 0.5)
  Top 0.508: C12.1 102.54,83.7 C13.1 | C13.1 103.94,85.05 | 103.94,85.05 U2.5 | 103.94,85.05 103.94,85.88 104.71,86.65 U2.3 105.94,86.67 106.74,86.67 107.53,85.88 114.2,85.88 U2.21 114.36,85.88 115.15,85.88 115.31,85.72 117.21,85.72 C15.1 117.37,85.88 118.96,85.88 126.58,93.5 U$4.GND_2 | ULTRA_1.4 20.38,90.8 20.38,73.97 20.06,73.65 20.06,72.07 21.33,70.8 JP3.7 21.49,70.8 23.87,70.8 JP3.5 24.03,70.8 26.41,70.8 JP3.3 26.57,70.8 28.95,70.8 JP3.1 | SMALL_LINE.6 99.91,63.33 99.91,68.1 102.77,70.95 RESET_LINE_SISTEM.4 | 151.34,48.57 151.34,46.35 129.28,24.28 129.28,23.81 JP6.10 | 151.34,48.57 151.34,54.76 R1.1 | 101.18,138.74 101.18,139.85 JP1.6 101.18,140.17 101.18,142.39 JP1.8 101.18,142.71 101.18,144.93 JP1.10 | 101.18,138.74 101.18,137.47 JP1.4 | v101.02,169.38 101.02,174.78 100.7,175.09 KICKER.6 | CONTROL_BOARD.21 118.01,109.21 120.39,109.21 CONTROL_BOARD.23 120.55,109.21 122.93,109.21 CONTROL_BOARD.25 123.09,109.05 123.09,102.23 125.94,99.37 U$4.GND_3 | v210.72,93.18 210.88,93.18 211.67,92.39 LED1.C | 194.96,111.06 197.81,108.21 v197.81,105.6 | 194.96,111.06 194.68,111.34 | ULTRA_RESET.4 186.59,85.72 192.46,85.72 ULTRA_RESET.3 | 101.18,138.74 116.58,138.74 v119.12,136.2 | 151.34,48.57 166.74,48.57 v171.66,53.49 | C13.1 101.64,84.59 v98.88,84.59 | 194.96,111.06 194.9,110.99 194.58,111.23
  Top 1.016: IO1.3 147.83,125.44 D1.A 149.63,123.64 C5.1 156.28,123.64 C7.MINUS | IO1.3 147.83,139.62 147.88,139.67 151.23,136.32 IO1.5 | IO1.3 IO1.6 138.99,141.23 133.03,135.26 133.03,130.84 C6.MINUS 139.91,126.94 C4.1 | ARDUINO_LED.C 156.91,121.81 C7.MINUS | C7.MINUS 154.51,119.4 151.97,119.4 150.39,117.82 150.39,87.63 144.65,81.9 | 144.65,81.9 144.16,81.4 139.52,81.4 129.23,91.69 129.23,93.82 129.16,93.89 | U$4.GND_2 129.16,93.89 | 129.16,93.89 129.16,97.69 127.88,98.97 U$4.GND_3 | 144.65,81.9 150.57,81.9 171.73,60.74 BATERY_3.3 171.73,78.13 179.19,85.59 ULTRA_RESET.4 183.13,85.59 181.87,86.85 181.87,104.8 183.17,106.1 ULTRA_SISTEM.6 | JP4.10 JP4.8 JP4.6 JP4.4 192.55,118.37 192.55,119.71 193.82,120.98 195.72,120.98 196.92,119.78 196.92,113.57 194.68,111.34 | 194.58,111.23 187.38,111.23 185.65,109.51 ULTRA_SISTEM.6 | ULTRA_SISTEM.6 187.4,106.1 188.62,104.88 188.62,100.99 191.83,97.78 ULTRA_3.4 | IO2.6 120.6,177.97 C9.1 125.06,187.4 126.15,188.49 C10.MINUS 132.84,189.46 C11.MINUS | IO2.6 124,177.85 IO2.5 | IO2.6 IO2.3 118.14,174.45 113.35,179.24 104,179.24 | C8.1 135.98,169.48 125.56,169.48 IO2.6 | 104,179.24 103.24,180 ULTRA_2.4 89.18,195.56 D2.A 77.85,195.56 RPI_LED.C | 104,179.24 101.71,179.24 100.51,178.04 KICKER.6
  Top 1.27: U$4.GND U$4.GND_1 88.12,91.33 LINE_SISTEM.6
  Bottom 0.508: C1.1 C2.1 196.5,105.6 v197.81,105.6 | 106.1,71.11 102.98,71.11 RESET_LINE_SISTEM.4 | 106.1,71.11 109.14,71.11 RESET_LINE_SISTEM.3 | 95.83,81.54 106.1,71.27 106.1,71.11 | 95.83,81.54 91.18,86.19 90.7,86.19 U$4.GND | JP3.1 29.11,70.64 81.97,70.64 89.27,63.33 99.75,63.33 SMALL_LINE.6 | v101.02,169.38 101.02,145.09 JP1.10 | C16.1 210.88,94.29 210.72,94.13 v210.72,93.18 210.56,93.34 209.13,93.34 U1.21 208.97,93.34 202.14,93.34 201.35,92.54 200.72,92.54 U1.3 200.4,92.54 199.76,92.54 199.6,92.7 | 199.6,92.7 199.45,92.86 199.45,93.81 199.76,94.13 200.4,94.13 U1.5 | 199.6,92.7 192.62,85.72 ULTRA_RESET.3 | v119.12,136.2 119.12,110.48 118.01,109.37 CONTROL_BOARD.21 | v171.66,53.49 171.66,58.41 BATERY_3.3 | v98.88,84.59 95.83,81.54
INT_KICK  (via drill 0.5)
  Top 0.508: v107.21,104.93 107.21,89.85 U2.32
  Bottom 0.508: v107.21,104.93 109.12,106.83 109.12,108.74 108.96,108.9 108.96,113.18 112.45,116.67 112.45,138.74 113.56,139.85 JP9.5
INT_MOTOR_LINE_1  (via drill 0.5)
  Top 0.508: v106.26,99.37 102.77,95.88 102.77,89.69 104.99,87.46 105.62,87.46 U2.2 | v138.49,102.86 v133.41,97.78
  Bottom 0.508: v106.26,99.37 124.04,99.37 125.63,97.78 v133.41,97.78 | v138.49,102.86 165.91,102.86 183.05,120 193.24,120 JP4.2
INT_MOTOR_LINE_2  (via drill 0.5)
  Top 0.508: U2.1 105.77,90.01 v103.97,91.81
  Bottom 0.508: v103.97,91.81 102.28,90.12 62.96,90.12 60.54,92.54 36.41,92.54 17.52,73.65 17.52,72.07 18.79,70.8 JP3.9
INT_SMALL_LINE  (via drill 0.5)
  Top 0.508: v105.94,65.56 106.1,65.4 110.86,65.4 111.5,66.03 111.5,72.79 107.21,77.07 107.21,81.11 U2.9
  Bottom 0.508: v105.94,65.56 104.67,65.56 103.56,64.45 103.56,44.92 128.64,19.84 132.93,19.84 134.2,21.11 JP6.5
KICK
  Bottom 0.508: CONTROL_BOARD.20 115.31,111.91 115.31,133.98 114.99,134.3 114.99,137.95 116.1,139.06 116.1,139.85 JP9.6
LINE_INTERUPT
  Top 0.508: U2.23 114.36,87.46 115.15,87.46 115.78,88.1 115.78,108.9 115.47,109.21 CONTROL_BOARD.19
MISO  (via drill 0.5)
  Top 0.508: v97.63,125.43 97.63,126.81 105.6,134.77 113.56,134.77 JP9.1 | JP5.3 192.3,70.64 185,63.33 180.07,63.33 173.3,56.55 170.08,56.55 168.65,57.99 v168.65,59.05 168.65,60.24 151.58,77.3 117.21,77.3 113.4,81.11 112.93,81.11 U2.16 113.09,81.27 113.09,82.86 112.45,83.5 v111.5,83.5 | v147.06,33.97 136.9,23.81 JP6.4 | v102.93,113.18 103.88,112.23 103.88,98.26 v103.08,97.47
  Bottom 0.508: JP2.8 21.49,118.42 22.28,118.42 29.27,125.41 97.6,125.41 v97.63,125.43 99.59,123.48 99.59,118.93 102.93,115.59 v102.93,113.18 | U1.16 209.15,98.73 211.07,98.73 211.99,97.81 211.99,88.58 195.32,71.91 193.57,71.91 192.46,70.8 JP5.3 | v147.06,33.97 147.06,37.46 v168.65,59.05 | v103.08,97.47 109.43,97.47 114.04,92.86 114.04,86.04 v111.5,83.5
MOSI  (via drill 0.5)
  Top 0.508: v112.13,82.54 112.13,81.27 U2.15 | v109.12,114.61 111.5,112.23 111.5,103.5 113.72,101.28 v113.72,94.45 | JP9.3 106.56,137.45 98.5,129.4 98.5,129.41 96.4,127.31 v96.4,126.99
  Bottom 0.508: 99.15,126.99 98.96,126.99 | 98.96,126.99 v96.4,126.99 28.31,126.99 19.74,118.42 18.95,118.42 JP2.10 | U1.15 206.79,98.07 206.79,99.04 207.57,99.83 211.09,99.83 212.78,98.14 212.78,85.15 212.55,83.27 200.01,70.72 JP5.1 182.55,58.29 181.7,58.29 142.97,19.56 136.09,19.56 135.47,20.18 135.47,24.12 137.22,25.87 | 137.22,25.87 139.28,23.81 JP6.2 | 137.22,25.87 135.8,27.29 135.8,55.2 113.4,77.59 113.4,81.27 v112.13,82.54 114.83,85.24 114.83,93.02 113.72,94.13 v113.72,94.45 | v109.12,114.61 109.12,116.83 98.96,126.99
MOTOR_A_A_1  (via drill 0.5)
  Top 0.508: v138.8,85.72 130.23,94.29 130.23,108.31 121.98,116.56 100.59,116.56 96.26,112.23 96.26,111.44 97.53,110.17 97.53,109.37 CONTROL_BOARD.5 | v176.74,78.73 184.68,70.8 JP5.9
  Bottom 0.508: v138.8,85.72 146.26,85.72 153.24,78.73 v176.74,78.73
MOTOR_A_A_2
  Bottom 0.508: JP2.2 29.11,118.26 93.72,118.26 100.07,111.91 CONTROL_BOARD.8
MOTOR_A_B_1  (via drill 0.5)
  Top 0.508: v132.93,94.77 132.93,96.99 132.24,97.68 132.24,109.32 123.12,118.43 99.17,118.43 93.72,112.98 93.72,110.64 94.99,109.37 CONTROL_BOARD.3
  Bottom 0.508: JP5.7 186.05,72.04 156.92,72.04 155.13,70.25 142.68,70.25 132.93,80 v132.93,94.77
MOTOR_A_B_2
  Bottom 0.508: JP2.4 26.57,118.42 27.36,118.42 28.47,119.53 94.99,119.53 102.61,111.91 CONTROL_BOARD.10
MOTOR_A_PWM_1  (via drill 0.5)
  Top 0.508: JP5.5 189.9,70.6 187.91,68.61 183.8,68.61 175.16,77.24 v175.16,79.84 | v140.39,95.72 140.63,95.96 140.63,104.01 124.16,120.48 96.83,120.48 91.18,114.83 91.18,110.64 92.45,109.37 CONTROL_BOARD.1
  Bottom 0.508: v175.16,79.84 156.27,79.84 v140.39,95.72
MOTOR_A_PWM_2
  Bottom 0.508: JP2.6 24.03,118.26 24.66,118.26 25.93,116.99 65.14,116.99 71.55,110.58 103.98,110.58 105.15,111.75 CONTROL_BOARD.12
MOTOR_B_A_1  (via drill 0.5)
  Top 0.508: v169.43,75.16 169.43,87.63 v156.27,100.8 | v125.66,110.12 125.66,111.26 121.35,115.56 101.34,115.56 97.69,111.91 CONTROL_BOARD.6
  Bottom 0.508: v169.43,75.16 169.43,75.09 170.38,74.15 183.17,74.15 JP5.10 | v156.27,100.8 134.98,100.8 v125.66,110.12
MOTOR_B_A_2
  Bottom 0.508: JP2.1 29.11,115.72 32.68,112.15 65.07,112.15 69.41,107.81 98.67,107.81 100.07,109.21 CONTROL_BOARD.7
MOTOR_B_B_1  (via drill 0.5)
  Top 0.508: v131.98,93.81 131.98,96.99 131.23,97.73 131.23,108.72 122.51,117.44 99.88,117.44 94.89,112.45 CONTROL_BOARD.4
  Bottom 0.508: JP5.8 187.5,73.26 188.65,72.11 188.65,69.36 181.74,62.45 147.87,62.45 131.98,78.34 v131.98,93.81
MOTOR_B_B_2
  Bottom 0.508: JP2.3 26.57,115.72 27.2,115.72 32.99,109.93 64.41,109.93 67.72,106.62 100.01,106.62 102.61,109.21 CONTROL_BOARD.9
MOTOR_B_PWM_1  (via drill 0.5)
  Top 0.508: v179.28,83.81 189.76,73.34 JP5.6 | v139.44,97.94 139.49,97.99 139.49,103.61 123.64,119.46 98.39,119.46 92.19,113.26 CONTROL_BOARD.2
  Bottom 0.508: v179.28,83.81 154.64,83.81 140.51,97.94 v139.44,97.94
MOTOR_B_PWM_2
  Bottom 0.508: JP2.5 24.03,115.72 24.66,115.72 38.08,102.31 98.24,102.31 105.15,109.21 CONTROL_BOARD.11
N$1
  Top 2.54: BATERY_1.3 42.7,137.48 63.07,157.85 BATERY_2.5
N$2
  Top 2.54: BATERY_2.3 150.52,157.85 171.73,136.64 BATERY_3.5
N$3  (via drill 0.5)
  Top 1.016: D2.K 88.83,185.05 TL2.1 89.59,183.19 95.9,176.88 95.9,171.03 101.6,165.33 129.04,165.33 132.16,162.21 139.43,162.21 140.35,163.13 v140.35,169.75 | IO2.2 132.94,172.74 136.55,176.36 v137.58,176.36
  Bottom 1.016: v140.35,169.75 137.69,172.41 137.69,176.27 137.6,176.36 v137.58,176.36
N$4
  Top 2.54: MAIN_POWER.2 64.73,95.1 68.03,98.41 FUSE.1
N$5
  Top 0.508: Y2.2 99.17,81.98 C13.2 103.08,81.98 104.56,83.45 U2.7
N$6
  Top 1.016: IO1.2 146.12,126.15 D1.K 146.86,121.23 146.86,109.5 141.9,104.55 TL1.1
N$7
  Bottom 0.508: C2.2 195.72,108.08 193.06,108.08 192.08,107.1 Y1.2 191.35,104.74 189.89,103.28 189.89,101.01 190.57,100.33 194.82,100.33 199.39,95.76 U1.7
N$8
  Bottom 0.508: Y1.1 195.2,102.02 C1.2 195.83,101.24 U1.8
N$9
  Top 0.508: C12.2 99.16,87.07 Y2.1 97.36,85.7 97.36,81.32 98.52,80.16 103.28,80.16 U2.8
N$12  (via drill 0.5)
  Top 0.508: v107.21,70.16 107.21,72.78 107.69,73.26 107.69,74.5 C14.2
  Bottom 0.508: v107.21,70.16 106.5,69.45 92.19,69.45 87.53,74.11 87.53,78.57 LINE_SISTEM.1
N$13  (via drill 0.5)
  Top 0.508: R2.1 103.72,75.4 105.31,75.4 C14.1 106.1,74.01 106.1,70 109.37,66.73 RESET_LINE_SISTEM.1 | v109.75,86.83 109.59,86.99 109.59,89.69 U2.29
  Bottom 0.508: v109.75,86.83 109.75,79.21 114.61,74.35 114.61,71.69 109.92,67 RESET_LINE_SISTEM.1 109.26,66.67 103.4,66.67 | 103.4,66.67 103.08,66.67 | 102.93,66.67 RESET_LINE_SISTEM.2 102.9,66.49 103.4,66.49 103.4,66.67
N$14  (via drill 0.6)
  Top 1.016: C6.PLUS 136.93,133.61 137.26,133.28 140.1,133.28 C4.2 142.83,130.56 IO1.1 144.42,128.48 140.12,124.17 133.95,124.17 131.44,126.68 131.44,138.09 135.41,142.07 | IO2.1 133.93,171.04 C8.2 134.74,171.9 136.99,174.15 139.22,174.15 v139.91,174.84 142.13,177.05 145.31,177.05 150.81,182.55 150.81,190.51 150.18,191.14 138.07,195.4 C10.PLUS | 135.41,142.07 135.52,142.17 | 135.41,142.07 135.41,145.88 135.41,155.97 143,163.55 143,169.27 v142.62,169.65
  Top 2.54: MOTOR.2 65.82,79.66 FUSE.2 68.03,90.45 74.52,96.93 74.52,105.27 66.51,113.28 66.51,122.1 93.71,149.3 131.99,149.3 135.41,145.88
  Bottom 1.016: v142.62,169.65 142.62,170.67 141.46,171.84 141.46,173.29 v139.91,174.84
N$16  (via drill 0.5)
  Top 0.508: v197.38,96.51 v201.99,91.91
  Bottom 0.508: v201.99,91.91 203.57,90.32 203.57,89.53 U1.30 | v197.38,96.51 187.7,96.51 185.79,98.42 ULTRA_SISTEM.3
N$17
  Bottom 0.508: U1.31 202.78,89.37 202.78,88.73 198.33,84.29 191.35,84.29 189.13,86.51 189.13,92.54 185.79,95.88 ULTRA_SISTEM.2
N$18
  Top 0.508: C3.2 186.27,88.58 186.27,92.86 185.79,93.34 ULTRA_SISTEM.1
N$19  (via drill 0.5)
  Top 0.508: v188.17,86.67 188.17,88.42 C3.1 | R8.1 195.32,82.86 194.37,82.86 192.62,81.11 ULTRA_RESET.1 192.46,81.11 186.11,81.11 ULTRA_RESET.2
  Bottom 0.508: v188.17,86.67 188.17,83.18 186.11,81.11 ULTRA_RESET.2 | U1.29 204.37,89.37 204.37,88.73 196.75,81.11 192.62,81.11 ULTRA_RESET.1
N$20
  Top 0.508: LED1.A 211.67,93.97 211.67,94.93 R5.1
N$22
  Top 1.016: ARDUINO_LED.A 156.83,115.02 R3.1
N$23
  Top 0.508: RPI_LED.A 70.52,189.74 R4.1
R_5V  (via drill 0.5)
  Top 0.508: CONTROL_BOARD.22 118.01,111.75 120.39,111.75 CONTROL_BOARD.24 120.55,111.75 122.93,111.75 CONTROL_BOARD.26 | IO2.4 131.17,176.24 128.23,176.24 v128.15,176.16
  Top 1.016: IO2.4 131.28,176.13 134,176.13 134.37,176.51 134.37,180.89 134.43,180.89 | TL2.2 91.5,170.66 v80.23,170.66 79.66,170.66 67.98,182.34 R4.2 | C11.PLUS 144.56,180.89 134.43,180.89 | 134.43,180.89 v133.03,182.29 132.89,182.43 C9.2
  Bottom 0.508: v128.15,176.16 123.09,171.1 123.09,111.91 CONTROL_BOARD.26
  Bottom 1.016: v133.03,182.29 117.18,182.29 114.06,185.41 94.98,185.41 v80.23,170.66
RAW_BATERY+
  Top 2.54: BATERY_1.5 42.7,80.46 52.64,90.41 MAIN_POWER.1
RESET_KICK
  Bottom 0.508: JP9.9 113.56,145.09 113.56,175.09 113.24,175.41 KICKER.1
RESET_SMALL_LINE
  Bottom 0.508: JP6.6 134.2,23.81 134.2,35.62 112.61,57.21 112.61,63.18 SMALL_LINE.1
RX_KICK
  Bottom 0.508: JP9.7 113.49,142.53 108.16,147.86 108.16,175.41 KICKER.3
RX_LINE_SISTEM  (via drill 0.5)
  Top 0.508: v107.37,87.46 108.8,88.89 108.8,89.69 U2.30 | v92.61,86.04 92.13,86.04 91.02,84.92 88.64,84.92 87.53,83.81 LINE_SISTEM.3
  Bottom 0.508: v107.37,87.46 100.86,87.46 99.43,86.04 v92.61,86.04
RX_SMALL_LINE
  Bottom 0.508: JP6.8 131.66,23.81 131.66,35.63 107.53,59.76 107.53,63.18 SMALL_LINE.3
SCK  (via drill 0.5)
  Top 0.508: JP9.2 116.1,134.77 114.81,133.48 106.12,133.48 v106.07,133.53 105.81,133.53 104.2,131.91 104.2,129.83 89.26,114.9 89.26,108.78 99.63,98.42 v101.66,98.42 | v209.92,97.47 210.56,96.83 211.51,96.83 R5.2 | v207.22,96.67 207.22,88.1 192.46,73.34 JP5.4 | v114.36,81.43 114.36,82.54 U2.17
  Bottom 0.508: v106.07,133.53 105.86,133.32 83.56,133.32 78.82,128.58 27.36,128.58 17.52,118.74 17.52,117.79 18.31,116.99 19.26,116.99 20.38,115.88 21.33,115.88 JP2.7 | v209.92,97.47 209.13,96.67 U1.17 208.97,96.67 v207.22,96.67 | v114.36,81.43 114.36,81.11 115.47,80 | 137.53,57.94 115.47,80 | 137.53,57.94 137.53,27.6 140.73,24.4 140.73,22.83 140.31,22.41 138.04,22.41 136.9,21.27 JP6.3 | JP5.4 192.3,73.18 192.3,72.38 191.19,71.27 191.19,70.32 181.67,60.79 148.17,60.79 145.47,58.1 137.69,58.1 137.53,57.94 | v101.66,98.42 111.02,98.42 115.63,93.81 115.63,80.16 115.47,80
SCL
  Top 0.508: U2.28 110.39,89.85 110.39,102.48 108.16,104.71 108.16,107.15 106.42,108.9 106.42,110.48 107.69,111.75 CONTROL_BOARD.14
SDA
  Top 0.508: U2.27 111.18,89.85 111.18,102.86 108.96,105.09 108.96,108.1 107.85,109.21 CONTROL_BOARD.13
SS_KICK  (via drill 0.5)
  Top 0.508: v108.8,83.5 108.8,81.27 U2.11 | v113.09,92.54 114.83,94.29 v114.83,107.78
  Bottom 0.508: v108.8,83.5 108.8,88.26 v113.09,92.54 | v114.83,107.78 115.63,107.78 116.58,108.74 116.58,133.66 117.37,134.45 117.37,136.2 116.26,137.31 JP9.4
SS_MOTOR_1  (via drill 0.5)
  Top 0.508: U2.13 110.46,81.15 110.46,79.32 118.66,71.11 152.93,71.11 v154.2,72.38
  Bottom 0.508: v154.2,72.38 154.52,72.38 158.4,76.27 191.91,76.27 194.84,73.34 JP5.2
SS_MOTOR_2  (via drill 0.5)
  Top 0.508: v109.75,77.15 109.66,77.24 U2.12 | v45.08,86.77 18.95,112.9 18.95,115.72 JP2.9
  Bottom 0.508: v109.75,77.15 109.75,76.56 112.41,73.91 112.41,71.18 109.66,68.43 86.61,68.43 68.27,86.77 v45.08,86.77
SS_SMALL_LINE  (via drill 0.5)
  Top 0.508: v119.59,66.03 108.01,77.62 108.01,81.11 U2.10 | v119.59,52.54 119.59,28.09 127.85,19.84 138.01,19.84 139.28,21.11 JP6.1
  Bottom 0.508: v119.59,52.54 v119.59,66.03
SS_ULTRA  (via drill 0.5)
  Top 0.508: v139.6,75.55 136.8,72.75 118.91,72.75 111.34,80.32 111.34,81.11 U2.14 | v191.83,77.78 192.94,77.78 205.32,90.16 v205.32,96.67
  Bottom 0.508: v139.6,75.55 140.23,75.55 142.08,77.41 191.46,77.41 v191.83,77.78 | v205.32,96.67 205.95,97.31 205.95,97.94 U1.14
TX_KICK
  Bottom 0.508: JP9.8 115.92,142.53 114.9,143.55 114.9,176.29 113.72,177.48 112.61,177.48 110.7,175.57 KICKER.2
TX_LINE_SISTEM  (via drill 0.5)
  Top 0.508: v108.89,92.83 108.01,91.94 108.01,89.85 U2.31 | v85.78,87.46 84.96,87.46 84.64,87.15 84.64,82.64 86.11,81.17 LINE_SISTEM.2
  Bottom 0.508: v108.89,92.83 107.65,92.83 103.4,88.58 92.13,88.58 91.02,87.46 v85.78,87.46
TX_SMALL_LINE
  Bottom 0.508: JP6.7 131.66,21.15 131.66,21.9 130.39,23.17 130.39,34.46 106.1,58.74 106.1,64.45 106.89,65.24 108.01,65.24 109.91,63.33 SMALL_LINE.2
U1
  Bottom 0.508: U1.9 201.99,98.1 201.99,104.74 196.86,109.86 191.86,109.86 188.49,106.5 188.49,100.96 187.37,99.85 127.06,99.85 126.58,100.32 63.24,100.32 60.06,97.15 21.65,97.15 20.53,96.04 ULTRA_1.2 20.38,95.72 20.38,93.5 ULTRA_1.3
U2
  Bottom 0.508: U1.10 202.78,98.1 202.78,112.98 187.18,128.58 178.33,128.58 126.58,180.33 109.59,180.33 108.48,181.44 ULTRA_2.2 108.16,181.44 105.94,181.44 ULTRA_2.3
U3  (via drill 0.5)
  Top 0.508: v203.57,96.67 199.45,96.67 198.03,98.1 195.79,98.1 ULTRA_3.3 ULTRA_3.2
  Bottom 0.508: v203.57,96.67 203.57,97.94 U1.11

### Text on the board
tNames: --> | B | C | - | + | --> | + | - | GND | - | + | Jakub Gal | 2020 | <-- | A | <-- | D